# Altium schematic sheet Multi.SchDoc
size 381 x 241 mm; SheetNumber: 1; SheetTotal: 4
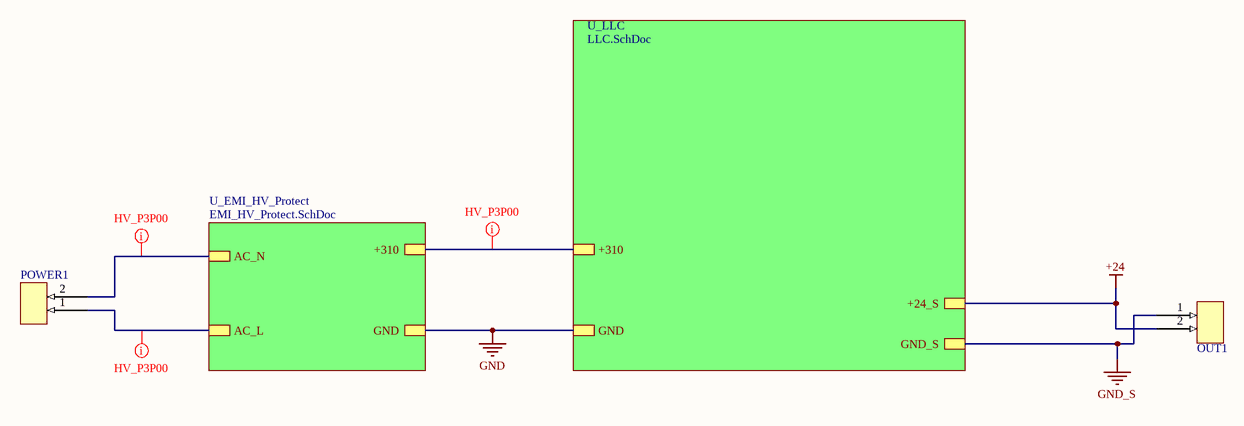
[diagram p0: Multi.SchDoc]

## Parts
OUT1  CONECTOR/FONIX/2PIN  [CONECTOR/FONIX/2PIN]  (value not drawn)
POWER1  CONECTOR/FONIX/2PIN  [CONECTOR/FONIX/2PIN]  (value not drawn)

## Sub-sheets
U_EMI_HV_Protect = EMI_HV_Protect.SchDoc: AC_L, AC_N, GND, +310
U_LLC = LLC.SchDoc: +24_S, GND_S, GND, +310

## Nets
+24: OUT1.2 ; sheet U_LLC/+24_S
GND: sheet U_EMI_HV_Protect/GND, sheet U_LLC/GND
GND_S: OUT1.1 ; sheet U_LLC/GND_S
NetPOWER1_1: POWER1.1 ; sheet U_EMI_HV_Protect/AC_L
NetPOWER1_2: POWER1.2 ; sheet U_EMI_HV_Protect/AC_N
(unnamed): sheet U_EMI_HV_Protect/+310, sheet U_LLC/+310

## Layout directives
net class PP300V: (no net found under the mark), NetPOWER1_1, NetPOWER1_2